# EasyEDA Pro project EMG_frontend.eprj, schematic Schematic1
Board Name: Board1; Create Date: 2025-03-20; Page Name: P1; Project Name: EMG_frontend; Schematic Name: Schematic1; Update Date: 2025-03-21; Company: EasyEDA.com; Page Size: A4; Version: V1.0
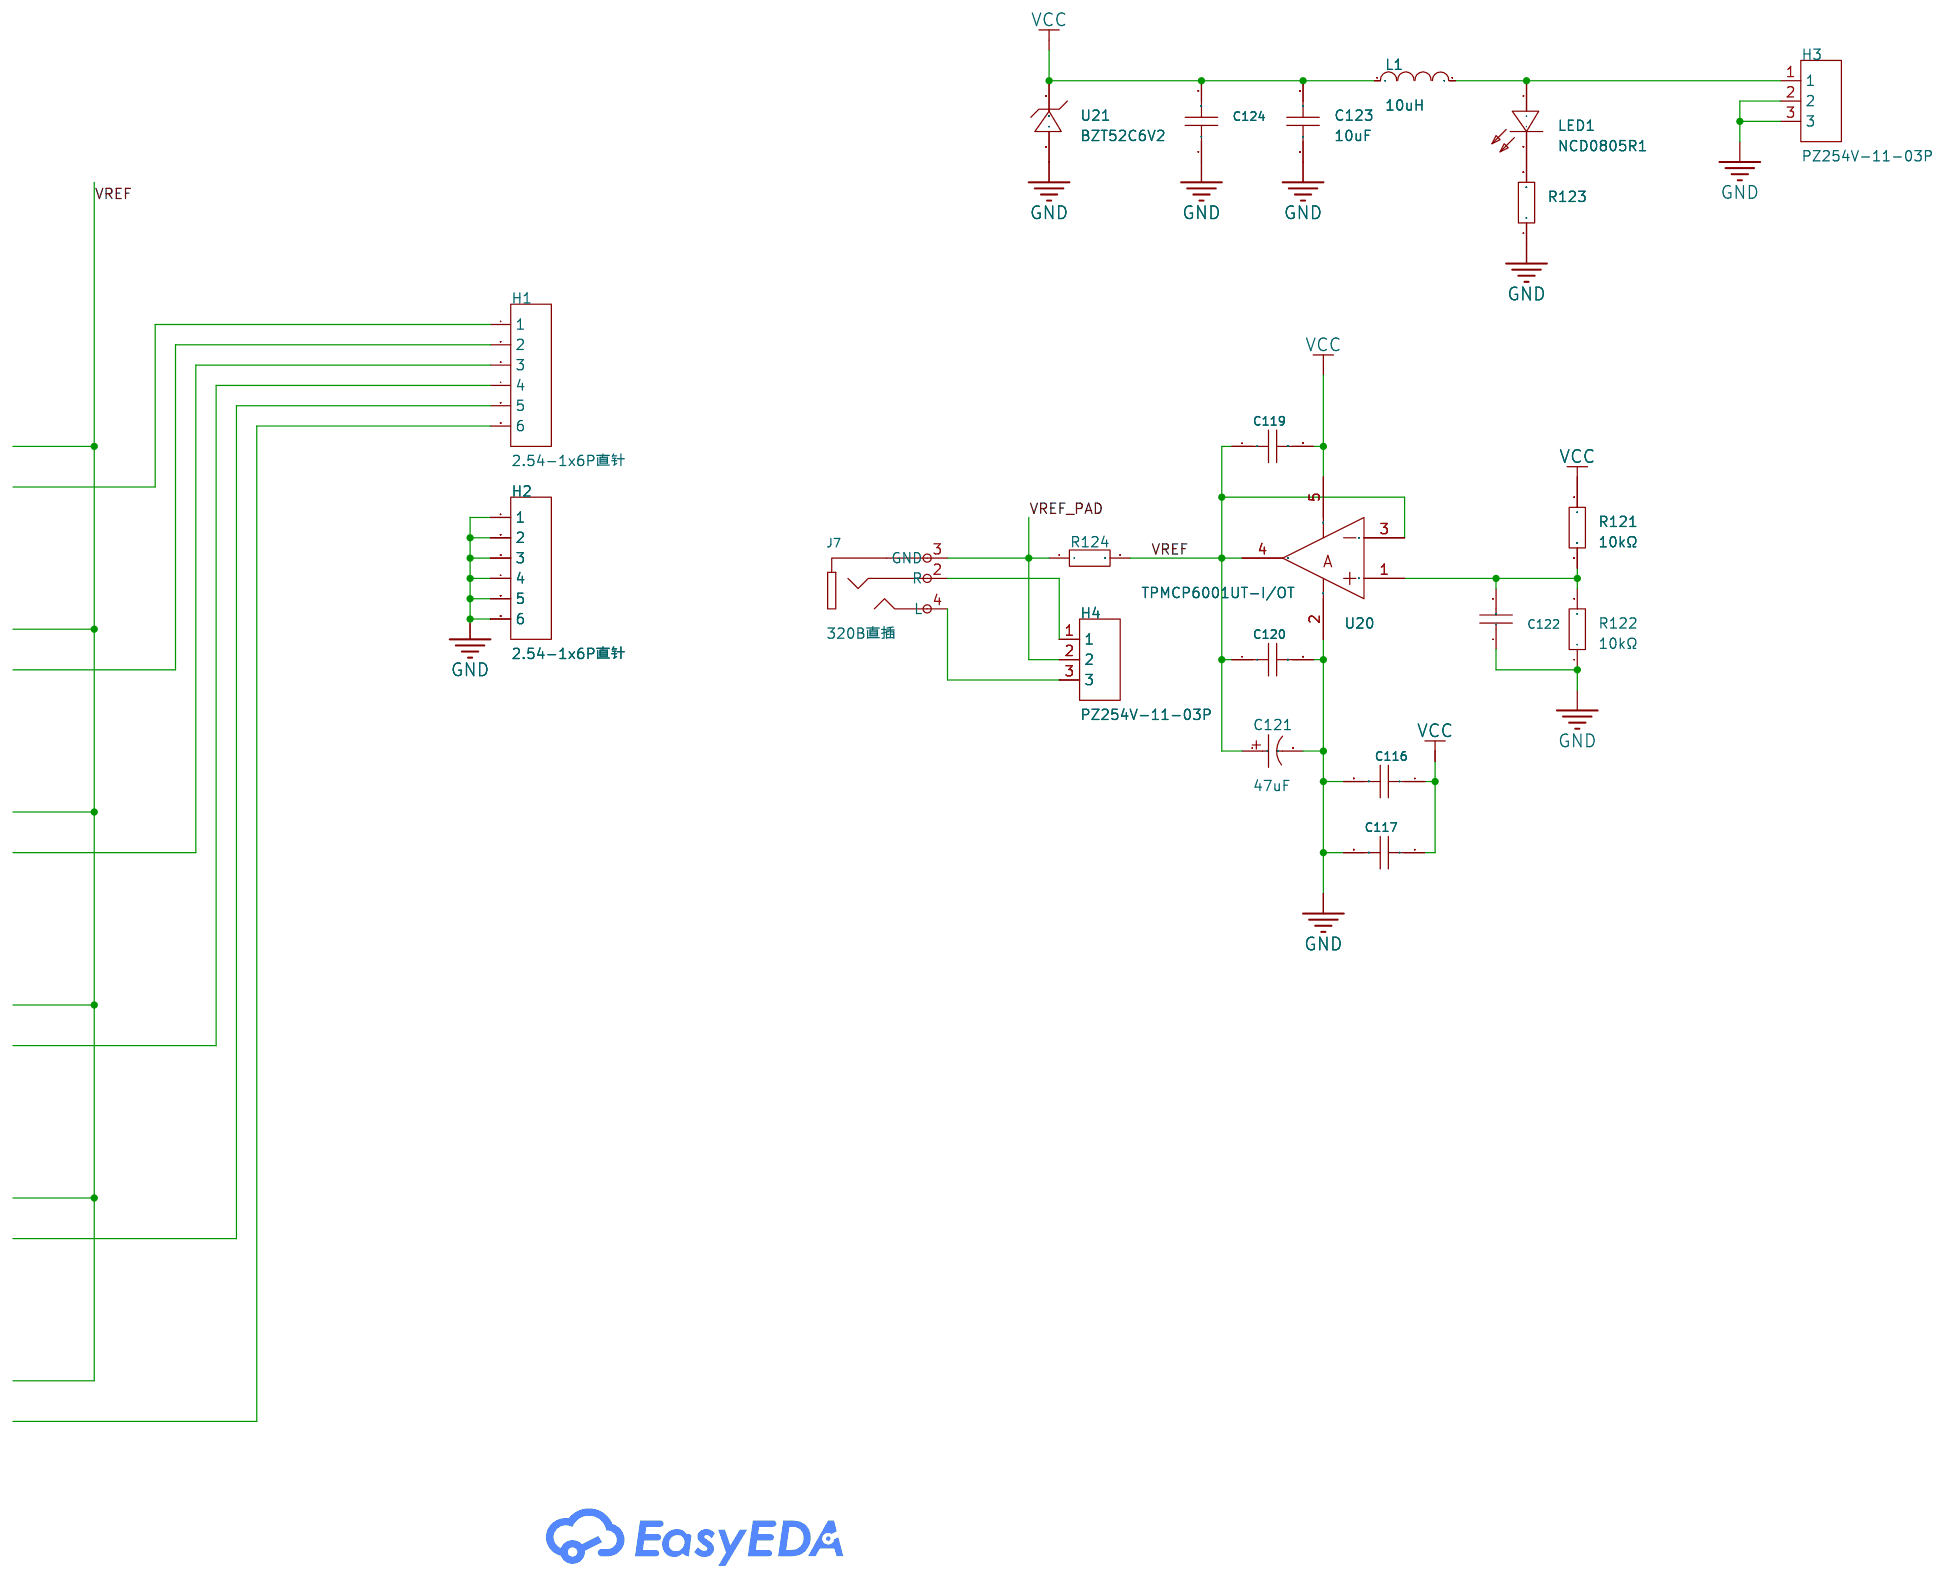
[diagram p1: schematic sheet]

## Parts
C116  1uF  [C0402]
C117  100nF  [C0402]
C119  100nF  [C0402]
C120  100nF  [C0402]
C121  47uF  [CAP-SMD_BD6.3-L6.6-W6.6-LS7.6-FD]
C122  10nF  [C0402]
C123  10uF  [C0805]
C124  100nF  [C0402]
CBB1  -
CBB2  -
CBB3  -
CBB4  -
CBB5  -
CBB6  -
H1  2.54-1x6P直针  [HDR-TH_6P-P2.54-V-M-1]
H2  2.54-1x6P直针  [HDR-TH_6P-P2.54-V-M-1]
H3  PZ254V-11-03P  [HDR-TH_3P-P2.54-V-M]
H4  PZ254V-11-03P  [HDR-TH_3P-P2.54-V-M]
J7  320B直插  [AUDIO-TH_PJ-3200]
L1  10uH  [L0805]
LED1  NCD0805R1  [LED0805-R-RD]
R121  10kΩ  [R0402]
R122  10kΩ  [R0402]
R123  8.2kΩ  [R0805]
R124  2kΩ  [R0402]
U20  TPMCP6001UT-I/OT  [SOT-23-5_L2.9-W1.6-P0.95-LS2.8-BR]
U21  BZT52C6V2  [SOD-123_L2.7-W1.6-LS3.7-RD]

## Library data of the parts
C116 = CL05A105KA5NQNC: Capacitance: Tolerance:±10% Tolerance:±10% Voltage Rated: Temperature Coefficient:; LCSC Part Name: 1uF ±10% 25V; Supplier Part: C52923; Manufacturer: SAMSUNG(三星); Supplier Footprint: 0402; JLCPCB Part Class: Basic Part; Datasheet: https://atta.szlcsc.com/upload/public/pdf/source/20160218/1457707763339.pdf; Supplier: LCSC; Tolerance: ±10%
C117 C119 C120 C124 = CL05B104KO5NNNC: Capacitance: Tolerance:±10% Tolerance:±10% Voltage Rated: Temperature Coefficient:; LCSC Part Name: 100nF ±10% 16V; Supplier Part: C1525; Manufacturer: SAMSUNG(三星); Supplier Footprint: 0402; JLCPCB Part Class: Basic Part; Datasheet: https://atta.szlcsc.com/upload/public/pdf/source/20160218/1457707763339.pdf; Supplier: LCSC; Tolerance: ±10%
C121 = RVT1H470M0607_C72523: Capacitance:47uF Tolerance:±20% Tolerance:±20% Voltage Rating:50V Ripple Current:66mA@120Hz Equivalent Series Resistance(ESR):- Diameter:6.3mm Height - Seated (Max):7.7mm Lifetime:2000hrs@105℃ Operating Temperature:-40℃~+105℃ Operating Temperature:-40℃~+1; LCSC Part Name: 47uF ±20% 50V; Supplier Part: C72523; Manufacturer: ROQANG(容强); Manufacturer Part: RVT1H470M0607; Supplier Footprint: SMD,D6.3xL7.7mm; JLCPCB Part Class: Extended Part; Datasheet: https://atta.szlcsc.com/upload/public/pdf/source/20170325/1490427950282.pdf; Supplier: LCSC; Tolerance: ±20%; Voltage Rating: 50V; Ripple Current: 66mA@120Hz; Diameter: 6.3mm; Height - Seated (Max): 7.7mm; Lifetime: 2000hrs@105℃; Operating Temperature: -40℃~+105℃
C122 = CL05B103KB5NNNC: Capacitance: Tolerance:±10% Tolerance:±10% Voltage Rated: Temperature Coefficient:; LCSC Part Name: 10nF ±10% 50V; Supplier Part: C15195; Manufacturer: SAMSUNG(三星); Supplier Footprint: 0402; JLCPCB Part Class: Basic Part; Datasheet: https://atta.szlcsc.com/upload/public/pdf/source/20160218/1457707763339.pdf; Supplier: LCSC; Tolerance: ±10%
C123 = CL21A106KAYNNNE_C15850: Capacitance: Tolerance:±10% Tolerance:±10% Voltage Rated: Temperature Coefficient:; LCSC Part Name: 10uF ±10% 25V; Supplier Part: C15850; Manufacturer: SAMSUNG(三星); Manufacturer Part: CL21A106KAYNNNE; Supplier Footprint: 0805; JLCPCB Part Class: Basic Part; Datasheet: https://atta.szlcsc.com/upload/public/pdf/source/20160218/1457707763339.pdf; Supplier: LCSC; Tolerance: ±10%
H1 H2 = 2.54-1x6P直针: Pin Structure:1x6P Pitch:2.54mm Row Spacing:- Circluar Pins/Square Pins:Policy Mounting Type:Straight Number of Rows:Single Row Number of Pins:6P Current Rating:3A Voltage Rating (Max):- Length of Mating Pin:- Insulation Height:- Contact Material:Brass Co; LCSC Part Name: 1x6P 间距:2.54mm 方针 直插; Supplier Part: C37208; Manufacturer: BOOMELE(博穆精密); Supplier Footprint: 插件,P=2.54mm; JLCPCB Part Class: Extended Part; Datasheet: https://atta.szlcsc.com/upload/public/pdf/source/20250115/42A019761A40C8B839643401D8CA5A96.pdf; Supplier: LCSC; Pin Structure: 1x6P; Pitch: 2.54mm; Circluar Pins/Square Pins: Policy; Mounting Type: Straight; Number of Rows: Single Row; Number of Pins: 6P; Current Rating: 3A; Contact Material: Brass; Operating Temperature: -40℃~+105℃; Color: Black
H3 H4 = PZ254V-11-03P: Pin Structure:1x3P Pitch:2.54mm Row Spacing:- Circluar Pins/Square Pins:Policy Mounting Type:Straight Number of Rows:Single Row Number of Pins:3P Current Rating:3A Voltage Rating (Max):250V Length of Mating Pin:6mm Insulation Height:2.5mm Length of End Co; LCSC Part Name: 1x3P 间距:2.54mm 方针 直插; Supplier Part: C2937625; Manufacturer: XFCN(兴飞); Supplier Footprint: 插件,P=2.54mm; JLCPCB Part Class: Extended Part; Datasheet: https://atta.szlcsc.com/upload/public/pdf/source/20200309/C492402_8335C3D49C4E4C618838D59BB1D024C1.pdf; Supplier: LCSC; Pin Structure: 1x3P; Pitch: 2.54mm; Circluar Pins/Square Pins: Policy; Mounting Type: Straight; Number of Rows: Single Row; Number of Pins: 3P; Current Rating: 3A; Voltage Rating (Max): 250V; Length of Mating Pin: 6mm; Insulation Height: 2.5mm; Length of End Connection Pin: 3mm; Operating Temperature: -40℃~+105℃; Color: Black
J7 = 320B直插: Connector Type:- Current Rating (Max):- Voltage Rating (Max):-; LCSC Part Name: 320B直插 黑色; Supplier Part: C18166; Manufacturer: BOOMELE(博穆精密); Supplier Footprint: 插件; JLCPCB Part Class: Extended Part; Supplier: LCSC
L1 = SDFL2012S100KTF: Inductance: Tolerance:±10% Tolerance:±10% Rated Current: Current - Saturation (Isat):- DC Resistance(DCR): Q @ Frequency:- Frequency - Self Resonant:- Ratings:; LCSC Part Name: 10uH ±10%; Supplier Part: C1046; Manufacturer: Sunlord(顺络); Supplier Footprint: 0805; JLCPCB Part Class: Basic Part; Datasheet: https://atta.szlcsc.com/upload/public/pdf/source/20231027/097A17DDB71564CE812E62F0F80142C9.pdf; Supplier: LCSC; Tolerance: ±10%
LED1 = NCD0805R1_C84256: Lamp Holder Type:- Emitted Color:Red Forward Voltage (VF):1.6V~2.6V Forward Voltage (VF):1.6V~2.6V Power Dissipation:65mW Forward Current:20mA Dominant Wavelength:615nm~630nm Dominant Wavelength:615nm~630nm Peak Wavelength:- Diode Configuration:独立二极管 Lens; Supplier Part: C84256; Manufacturer: 国星光电; Supplier Footprint: 0805; JLCPCB Part Class: Basic Part; Datasheet: https://atta.szlcsc.com/upload/public/pdf/source/20200820/C84256_F0A75A43B3EAD75808600A0514C76B99.pdf; Supplier: LCSC; Emitted Color: Red; Forward Voltage (VF): 1.6V~2.6V; Power Dissipation: 65mW; Forward Current: 20mA; Dominant Wavelength: 615nm~630nm; Diode Configuration: 独立二极管; Lens Color: 无色透明透镜; Luminous Intensity: 67mcd~195mcd; Viewing Angle: 130°; Operating Temperature: -30℃~+85℃
R121 R122 = 0402WGF1002TCE: Type:Thick Film Resistors Resistance:10kΩ Tolerance:±1% Tolerance:±1% Power(Watts): Overload Voltage (Max): Temperature Coefficient:±100ppm/℃ Temperature Coefficient:±100ppm/℃ Operating Temperature Range:-55℃~+155℃ Operating Temperature Range:-55℃~+155℃; LCSC Part Name: 10kΩ ±1% 62.5mW 厚膜电阻; Supplier Part: C25744; Manufacturer: UNI-ROYAL(厚声); Supplier Footprint: 0402; JLCPCB Part Class: Basic Part; Datasheet: https://atta.szlcsc.com/upload/public/pdf/source/20200306/C422600_1E6D84923E4A46A82E41ADD87F860B5C.pdf; Supplier: LCSC; Type: Thick Film Resistors; Tolerance: ±1%; Temperature Coefficient: ±100ppm/℃; Operating Temperature Range: -55℃~+155℃
R123 = 0805W8F8201T5E: Type:Thick Film Resistors Resistance:8.2kΩ Tolerance:±1% Tolerance:±1% Power(Watts): Overload Voltage (Max): Temperature Coefficient:±100ppm/℃ Temperature Coefficient:±100ppm/℃ Operating Temperature Range:-55℃~+155℃ Operating Temperature Range:-55℃~+155℃; LCSC Part Name: 8.2kΩ ±1% 125mW 厚膜电阻; Supplier Part: C17828; Manufacturer: UNI-ROYAL(厚声); Supplier Footprint: 0805; JLCPCB Part Class: Basic Part; Datasheet: https://atta.szlcsc.com/upload/public/pdf/source/20200306/C422600_1E6D84923E4A46A82E41ADD87F860B5C.pdf; Supplier: LCSC; Type: Thick Film Resistors; Tolerance: ±1%; Temperature Coefficient: ±100ppm/℃; Operating Temperature Range: -55℃~+155℃
R124 = 0402WGF2001TCE: Type:Thick Film Resistors Resistance:2kΩ Tolerance:±1% Tolerance:±1% Power(Watts): Overload Voltage (Max): Temperature Coefficient:±100ppm/℃ Temperature Coefficient:±100ppm/℃ Operating Temperature Range:-55℃~+155℃ Operating Temperature Range:-55℃~+155℃; LCSC Part Name: 2kΩ ±1% 62.5mW 厚膜电阻; Supplier Part: C4109; Manufacturer: UNI-ROYAL(厚声); Supplier Footprint: 0402; JLCPCB Part Class: Basic Part; Datasheet: https://atta.szlcsc.com/upload/public/pdf/source/20200306/C422600_1E6D84923E4A46A82E41ADD87F860B5C.pdf; Supplier: LCSC; Type: Thick Film Resistors; Tolerance: ±1%; Temperature Coefficient: ±100ppm/℃; Operating Temperature Range: -55℃~+155℃
U20 = TPMCP6001UT-I/OT: Number of Channels:Single channel Maximum Power Supply Range (Vdd-Vss):5.5V Rail to Rail:rail-to-rail input,rail-to-rail output Gain Bandwidth Product:1MHz Vos - Input Offset Voltage:5mV Input Offset Voltage Drift(Vos TC):2uV/℃ Slew Rate:0.6V/us Noise den; Supplier Part: C2940623; Manufacturer: TECH PUBLIC(台舟); Supplier Footprint: SOT-23-5; JLCPCB Part Class: Extended Part; Datasheet: https://atta.szlcsc.com/upload/public/pdf/source/20220110/D6474F4998EFABE2A658B4E9F59770CE.pdf; Supplier: LCSC; Number of Channels: Single channel; Maximum Power Supply Range (Vdd-Vss): 5.5V; Rail to Rail: rail-to-rail input,rail-to-rail output; Gain Bandwidth Product: 1MHz; Vos - Input Offset Voltage: 5mV; Input Offset Voltage Drift(Vos TC): 2uV/℃; Slew Rate: 0.6V/us; Noise density(eN): 20nV/√Hz@10kHz; Common Mode Rejection Ratio(CMRR): 75dB; Operating Temperature: -40℃~+125℃
U21 = BZT52C6V2_C2910064: Diode Configuration:Independent Type Zener Voltage (Nom):6.2V Reverse Leakage Current (Ir):3uA@4V Zener Voltage (Range):5.8V~6.6V Zener Voltage (Range):5.8V~6.6V Power Dissipation:500mW Zener Impedance (Zzt):10Ω; Supplier Part: C2910064; Manufacturer: CJ(江苏长电/长晶); Supplier Footprint: SOD-123; JLCPCB Part Class: Extended Part; Datasheet: https://atta.szlcsc.com/upload/public/pdf/source/20241016/795349FCDA3654D67233C1A7D319DD86.pdf; Supplier: LCSC; Diode Configuration: Independent Type; Zener Voltage (Nom): 6.2V; Reverse Leakage Current (Ir): 3uA@4V; Zener Voltage (Range): 5.8V~6.6V; Power Dissipation: 500mW; Zener Impedance (Zzt): 10Ω

## Nets
GND: C116.2 C117.2 C120.2 C121.2 C122.1 C123.1 C124.1 H2.1 H2.2 H2.3 H2.4 H2.5 H2.6 H3.2 H3.3 R122.1 R123.1 U20.2(-VS) U21.2(A)
VCC: C116.1 C117.1 C119.2 C123.2 C124.2 L1.1 R121.1 U20.5(+VS) U21.1(C)
VREF: C119.1 C120.1 C121.1 CBB1.(OUT) CBB2.(OUT) CBB3.(OUT) CBB4.(OUT) CBB5.(OUT) CBB6.(OUT) H1.1 H1.2 H1.3 H1.4 H1.5 H1.6 R124.2 U20.3(-IN) U20.4(OUT)
VREF_PAD: H4.2 J7.3(GND) R124.1
$5N672: C122.2 R121.2 R122.2 U20.1(+IN)
$5N676: H3.1 L1.2 LED1.1(+)
$5N1514: LED1.2(-) R123.2
$5N6446: H4.1 J7.2(R)
$5N6450: H4.3 J7.4(L)
